# Altium schematic sheet CAN.SchDoc
size A; SheetNumber: 3; SheetTotal: 3
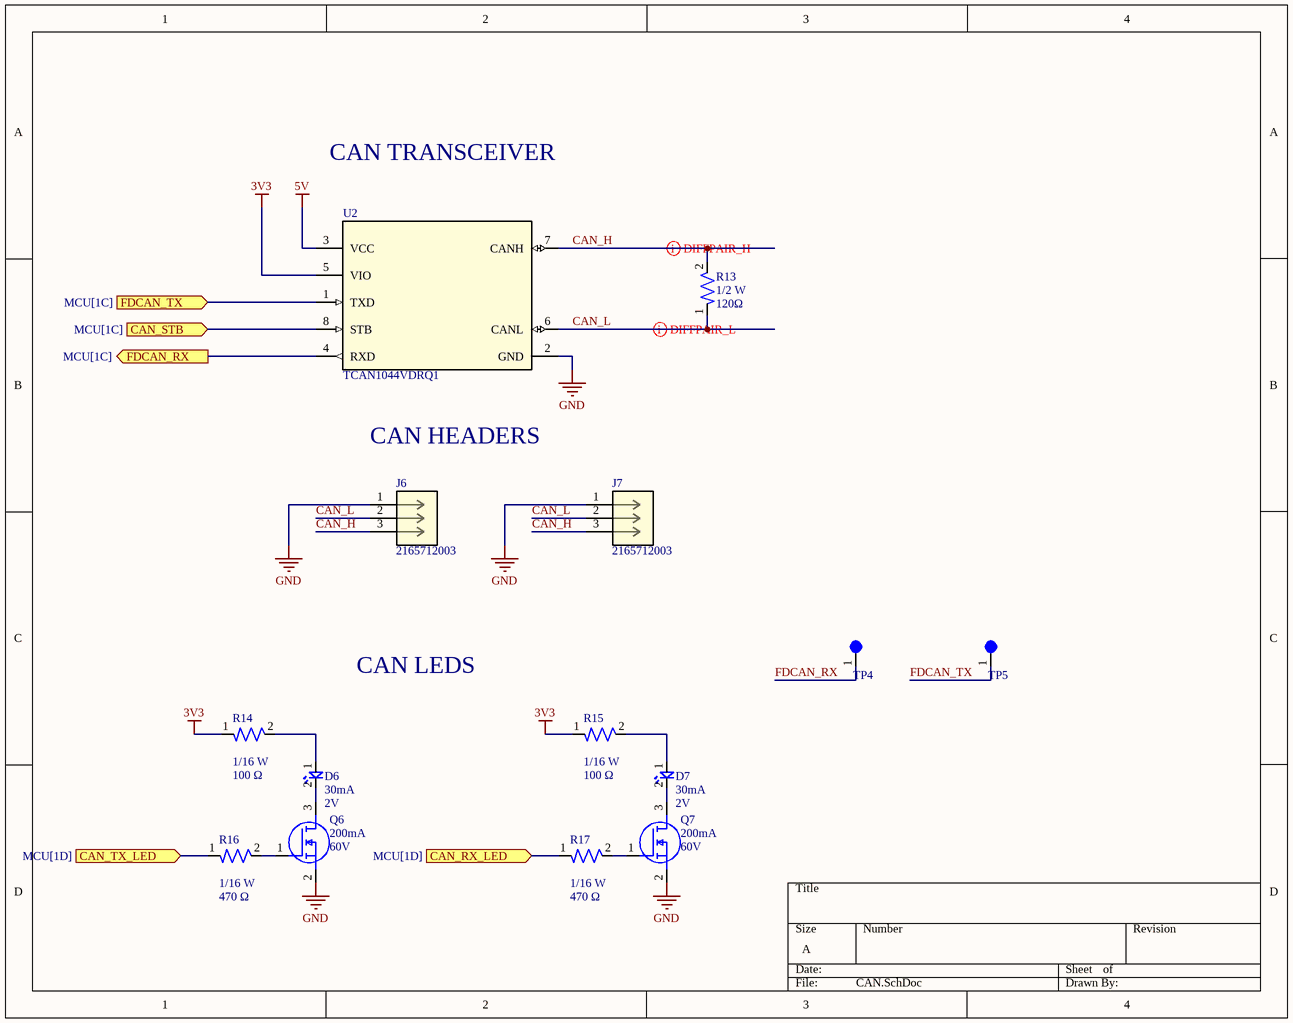
[diagram p0: CAN.SchDoc]

## Parts
D6  Forward Current: 30mA  Forward Voltage: 2V  [LED-0603]  (hidden comment: BL-HKC36G-AV-TRB)
D7  Forward Current: 30mA  Forward Voltage: 2V  [LED-0603]  (hidden comment: BL-HKC36G-AV-TRB)
J6  2165712003  [CONN_2165710003-SD_03_MOL]
J7  2165712003  [CONN_2165710003-SD_03_MOL]
Q6  Continuous Current: 200mA  Voltage: 60V  [IC-SOT23-3]  (hidden comment: T2N7002AK,LM)
Q7  Continuous Current: 200mA  Voltage: 60V  [IC-SOT23-3]  (hidden comment: T2N7002AK,LM)
R13  Wattage: 1/2 W  Resistance: 120Ω  [RES-1210]  (hidden comment: RC1210FR-07120RL)
R14  Wattage: 1/16 W  Resistance: 100 Ω  [RES-0402]  (hidden comment: RC0402FR-07100RL)
R15  Wattage: 1/16 W  Resistance: 100 Ω  [RES-0402]  (hidden comment: RC0402FR-07100RL)
R16  Wattage: 1/16 W  Resistance: 470 Ω  [RES-0402]  (hidden comment: RC0402FR-07470RL)
R17  Wattage: 1/16 W  Resistance: 470 Ω  [RES-0402]  (hidden comment: RC0402FR-07470RL)
TP4  5003  [TEST-POINT-0001]  (value not drawn)
TP5  5003  [TEST-POINT-0001]  (value not drawn)
U2  TCAN1044VDRQ1  [IC-8SOIC]

## Ports
CAN_RX_LED (in, see MCU[1D]), CAN_STB (in, see MCU[1C]), CAN_TX_LED (in, see MCU[1D]), FDCAN_RX (out, see MCU[1C]), FDCAN_TX (in, see MCU[1C])

## Nets
3V3: R14.1 R15.1 U2.5(VIO)
5V: U2.3(VCC)
GND: J6.1 J7.1 Q6.2(S) Q7.2(S) U2.2(GND)
CAN_H: J6.3 J7.3 R13.2 U2.7(CANH)
CAN_L: J6.2 J7.2 R13.1 U2.6(CANL)
CAN_RX_LED: R17.1 ; port CAN_RX_LED
CAN_STB: U2.8(STB) ; port CAN_STB
CAN_TX_LED: R16.1 ; port CAN_TX_LED
FDCAN_RX: U2.4(RXD) ; port FDCAN_RX
FDCAN_RX: TP4.1  [a separate net that carries the same name]
FDCAN_TX: U2.1(TXD) ; port FDCAN_TX
FDCAN_TX: TP5.1  [a separate net that carries the same name]
NetD6_1: D6.1 R14.2
NetD6_2: D6.2 Q6.3(D)
NetD7_1: D7.1 R15.2
NetD7_2: D7.2 Q7.3(D)
NetQ6_1: Q6.1(G) R16.2
NetQ7_1: Q7.1(G) R17.2

## Layout directives
differential pair: CAN_H, CAN_L

## Notes on the sheet
- CAN TRANSCEIVER
- CAN HEADERS
- CAN LEDS

## Library data of the parts
D6 D7 = LED-0001: LED YELLOW CLEAR 0603 SMD; ComponentLink1Description: Datasheet; ComponentLink1URL: https://www.americanbrightled.com/pdffiles/led-components/smt/BL-HKC36G-AV-TRB.pdf
J6 J7 = CONN MF+ 3 PIN VERT: Micro-Fit+ Vertical Header, Through Hole, 3.00mm Pitch, Single Row, 3 Circuits, 0.38Âµm Gold (Au) Plating, Glow-Wire Capable, Black; Manufacturer_Name: Molex Connector Corporation; Copyright: Copyright (C) 2026 Ultra Librarian. All rights reserved.; Manufacturer_Part_Number: 2165712003; RefDes: RefDes; Type: Type
Q6 Q7 = NMOS-200MA-0001: MOSFET N-CH 60V 200MA SOT23; ComponentLink1Description: Datasheet; ComponentLink1URL: https://toshiba.semicon-storage.com/info/T2N7002AK_datasheet_en_20150401.pdf?did=29712&prodName=T2N7002AK
R13 = RES CAN TERM 1210
R14-R17 = RES 0402
TP4 TP5 = TEST-POINT-0001: Oranange PC Test Point, Miniature Phoisphor Bronze Silver Plating Through Hole Mounting Type
U2 = IC-CAN-0001: IC TRANSCEIVER 1/1 8SOIC; ComponentLink1Description: Datasheet; ComponentLink1URL: https://www.ti.com/lit/ds/symlink/tcan1044-q1.pdf?HQS=dis-dk-null-digikeymode-dsf-pf-null-wwe&ts=1728758303289&ref_url=https%253A%252F%252Fwww.ti.com%252Fgeneral%252Fdocs%252Fsuppproductinfo.tsp%253FdistId%253D10%2526gotoUrl%253Dhttps%253A%252F%252Fwww.ti.com%252Flit%252Fgpn%252Ftcan1044-q1